# EAGLE design lna (EAGLE 8.5.1)
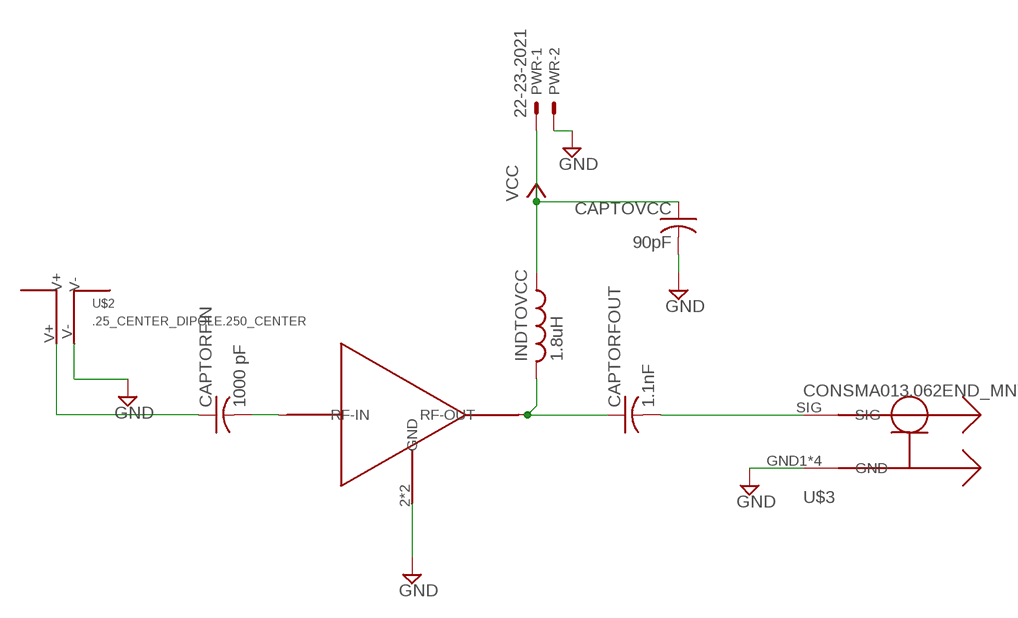
[diagram p0: schematic, sheet 1]

## Parts
CAPTORFIN  1000 pF  C-USC0603  [C0603]
CAPTORFOUT  1.1nF  C-USC0603  [C0603]
CAPTOVCC  90pF  C-USC0603  [C0603]
INDTOVCC  1.8uH  L-USL2012C  [L2012C]
PWR  22-23-2021  [22-23-2021]
U$1  PSA4-5043+  [PSA4-5043+]
U$2  .25_CENTER_DIPOLE.250_CENTER  [.25_SPACING]
U$3  CONSMA013.062END_MNT  [SMA_EDGE_MNT]

## Nets
GND: CAPTOVCC.2 PWR.2 U$1.2(GND) U$1.4(GND) U$2.V- U$3.GND1(GND) U$3.GND2(GND) U$3.GND3(GND) U$3.GND4(GND)
N$1: CAPTORFIN.1 U$2.V+
N$2: CAPTORFOUT.1 INDTOVCC.2 U$1.1(RF-OUT)
N$3: CAPTORFOUT.2 U$3.SIG
N$4: CAPTORFIN.2 U$1.3(RF-IN)
VCC: CAPTOVCC.1 INDTOVCC.1 PWR.1

## Library data of the parts
CAPTORFIN CAPTORFOUT CAPTOVCC = rcl:C-US: CAPACITOR, American symbol; SPICEPREFIX: C
INDTOVCC = rcl:L-US: INDUCTOR, American symbol; SPICEPREFIX: L
PWR = con-molex:22-23-2021: .100" (2.54mm) Center Header - 2 Pin; MF: MOLEX; MPN: 22-23-2021; OC_FARNELL: 1462926; OC_NEWARK: 25C3832
U$1 = PSA4-5043_:PSA4-5043+; AVAILABILITY: Unavailable; DESCRIPTION: Ultra Low Noise MMIC Amplifier, 50ohm, 0.05 to 4 GHz; MF: Mini-Circuits; MP: PSA4-5043+; PACKAGE: None; PRICE: None
U$2 = balun:.25_CENTER_DIPOLE
U$3 = balun:CONSMA013.062

## Board
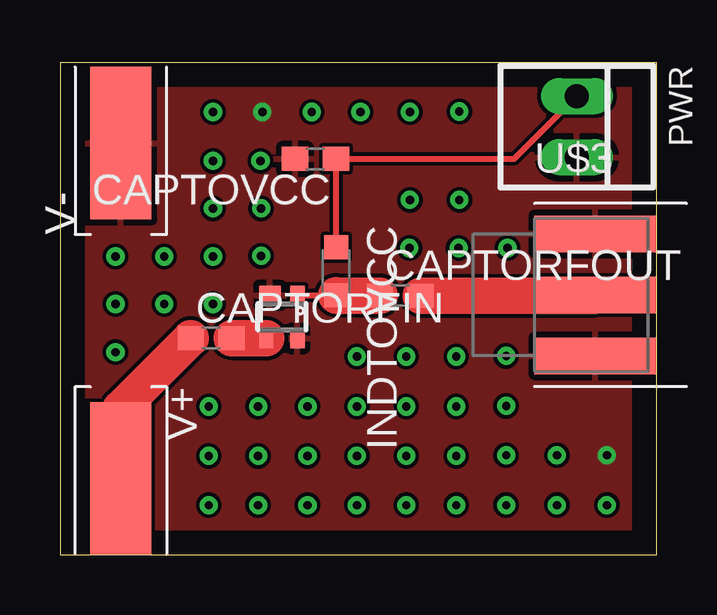
[diagram p1: board, top side]
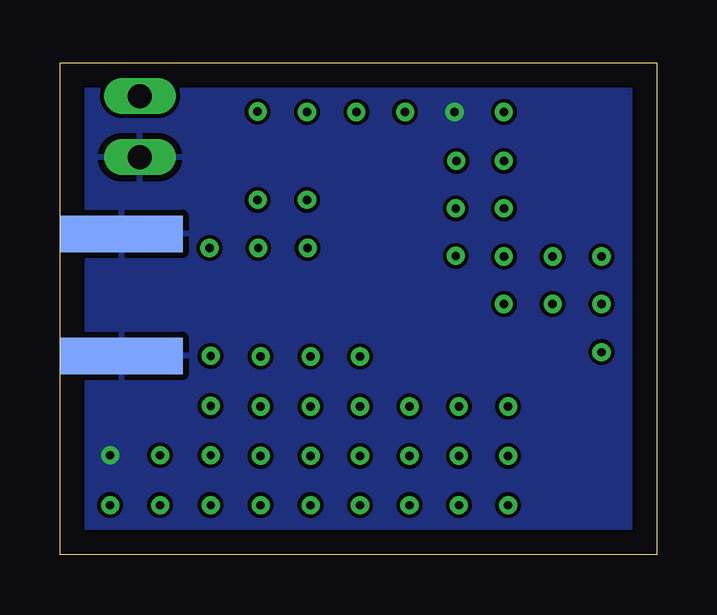
[diagram p2: board, bottom side, seen from below]

Size 24.87 x 20.5 mm. Coordinates in mm from the lower left corner, seen from the top.
Outline: 0,0 24.87,0 24.87,20.5 0,20.5 0,0
Copper layers (1*16): Top 0.035mm / dielectric 1.5mm / Bottom 0.035mm
Design rules "default": minimum track width 6mil, minimum drill 0.35mm, track to track 6mil, track to pad 6mil, pad to pad 6mil, via to via 6mil, smd to smd 6mil, copper to edge 40mil, drill to drill 6mil, minimum pad ring 10mil, minimum via ring 8mil, stop-mask expansion 4mil, vias tented up to drill 0mil, thermal gap 10mil

### Footprints (pad centres in the part's own frame; a part is rotated, then mirrored left to right if it is on the bottom)
C0603 = smd 1.1 x 1: 1 -0.85,0; 2 0.85,0
L2012C = smd 1 x 1: 1 -1,0; 2 1,0
22-23-2021 = drill 1 long: 1 -1.27,0; 2 1.27,0
PSA4-5043+ = smd 0.6 x 0.8: 1 -0.65,-0.9; 3 0.65,0.9; 4 -0.65,0.9 | smd 0.9 x 0.8: 2 0.5,-0.9
.25_SPACING = smd 6.35 x 2.54: V+ 9.525,0; V- -4.445,0
SMA_EDGE_MNT = smd 1.524 x 5.08 bottom: GND1 -2.54,0; GND2 2.54,0 | smd 1.524 x 5.08: GND3 -2.54,0; GND4 2.54,0; SIG 0,0

### Placement (x,y rotation side)
CAPTORFIN  6.3,9.02 0 top
CAPTORFOUT  14.17,10.79 0 top
CAPTOVCC  10.64,16.48 180 top
INDTOVCC  11.51,11.81 270 top
PWR  21.54,17.83 270 top
U$1  9.25,9.91 180 top
U$2  2.54,12.7 270 top
U$3  22.3,10.82 90 top

### Tracks (layer width: path | path; a pad name or v marks a point on that pad's centre or on a via)
GND  (via drill 0.35)
  other vias: 22.78,4.14 8.43,18.44
  pour Top: -0.03,20.55 -0.03,0.03 arc90 0.1,0 24.89,0 24.89,20.47 arc90 24.87,20.5 0.08,20.5
  pour Bottom: 0.03,20.45 0.03,0.05 arc90 0.05,0.03 24.87,0.03 24.87,20.55 arc90 24.84,20.57 0,20.57
N$1
  Top 1.524: U$2.V+ 2.54,6.11 CAPTORFIN.1
N$2
  Top 0.254: U$1.1 INDTOVCC.2 11.52,10.79
  Top 1.524: CAPTORFOUT.1 11.52,10.79 INDTOVCC.2
N$3
  Top 1.524: CAPTORFOUT.2 22.28,10.79 U$3.SIG
N$4
  Top 1.524: CAPTORFIN.2 8.59,9.02 U$1.3
N$5  (via drill 0.35)
  other vias: 22.78,2.06
N$6  (via drill 0.35)
  other vias: 20.7,2.06
N$7  (via drill 0.35)
  other vias: 18.59,2.06
N$8  (via drill 0.35)
  other vias: 16.51,2.06
N$9  (via drill 0.35)
  other vias: 14.43,2.06
N$10  (via drill 0.35)
  other vias: 12.37,2.06
N$11  (via drill 0.35)
  other vias: 10.31,2.06
N$12  (via drill 0.35)
  other vias: 8.26,2.06
N$13  (via drill 0.35)
  other vias: 6.2,2.06
N$14  (via drill 0.35)
  other vias: 20.7,4.14
N$15  (via drill 0.35)
  other vias: 18.59,4.14
N$16  (via drill 0.35)
  other vias: 16.51,4.11
N$17  (via drill 0.35)
  other vias: 14.43,4.11
N$18  (via drill 0.35)
  other vias: 12.37,4.11
N$19  (via drill 0.35)
  other vias: 10.31,4.11
N$20  (via drill 0.35)
  other vias: 8.26,4.11
N$21  (via drill 0.35)
  other vias: 6.2,4.11
N$22  (via drill 0.35)
  other vias: 6.2,6.17
N$23  (via drill 0.35)
  other vias: 8.26,6.17
N$24  (via drill 0.35)
  other vias: 10.31,6.17
N$25  (via drill 0.35)
  other vias: 12.37,6.17
N$26  (via drill 0.35)
  other vias: 14.43,6.17
N$27  (via drill 0.35)
  other vias: 16.51,6.17
N$28  (via drill 0.35)
  other vias: 18.59,6.2
N$29  (via drill 0.35)
  other vias: 18.59,8.28
N$30  (via drill 0.35)
  other vias: 16.51,8.26
N$31  (via drill 0.35)
  other vias: 14.43,8.26
N$32  (via drill 0.35)
  other vias: 12.37,8.26
N$33  (via drill 0.35)
  other vias: 18.64,12.78
N$34  (via drill 0.35)
  other vias: 16.61,12.78
N$35  (via drill 0.35)
  other vias: 14.55,12.78
N$36  (via drill 0.35)
  other vias: 16.64,14.78
N$37  (via drill 0.35)
  other vias: 14.58,14.78
N$38  (via drill 0.35)
  other vias: 16.64,18.47
N$39  (via drill 0.35)
  other vias: 14.58,18.44
N$40  (via drill 0.35)
  other vias: 12.52,18.44
N$41  (via drill 0.35)
  other vias: 10.49,18.44
N$42  (via drill 0.35)
  other vias: 6.38,18.44
N$43  (via drill 0.35)
  other vias: 6.38,16.41
N$44  (via drill 0.35)
  other vias: 8.36,16.41
N$45  (via drill 0.35)
  other vias: 8.38,14.43
N$46  (via drill 0.35)
  other vias: 8.38,12.45
N$47  (via drill 0.35)
  other vias: 6.38,14.43
N$48  (via drill 0.35)
  other vias: 6.38,12.42
N$49  (via drill 0.35)
  other vias: 4.34,12.42
N$50  (via drill 0.35)
  other vias: 2.31,12.42
N$51  (via drill 0.35)
  other vias: 2.31,10.44
N$52  (via drill 0.35)
  other vias: 4.34,10.44
N$53  (via drill 0.35)
  other vias: 6.38,10.44
N$54  (via drill 0.35)
  other vias: 2.31,8.43
VCC
  Top 0.254: INDTOVCC.1 11.51,16.47 CAPTOVCC.1 18.92,16.48 PWR.1